# Altium project PressureSensor.PrjPcb
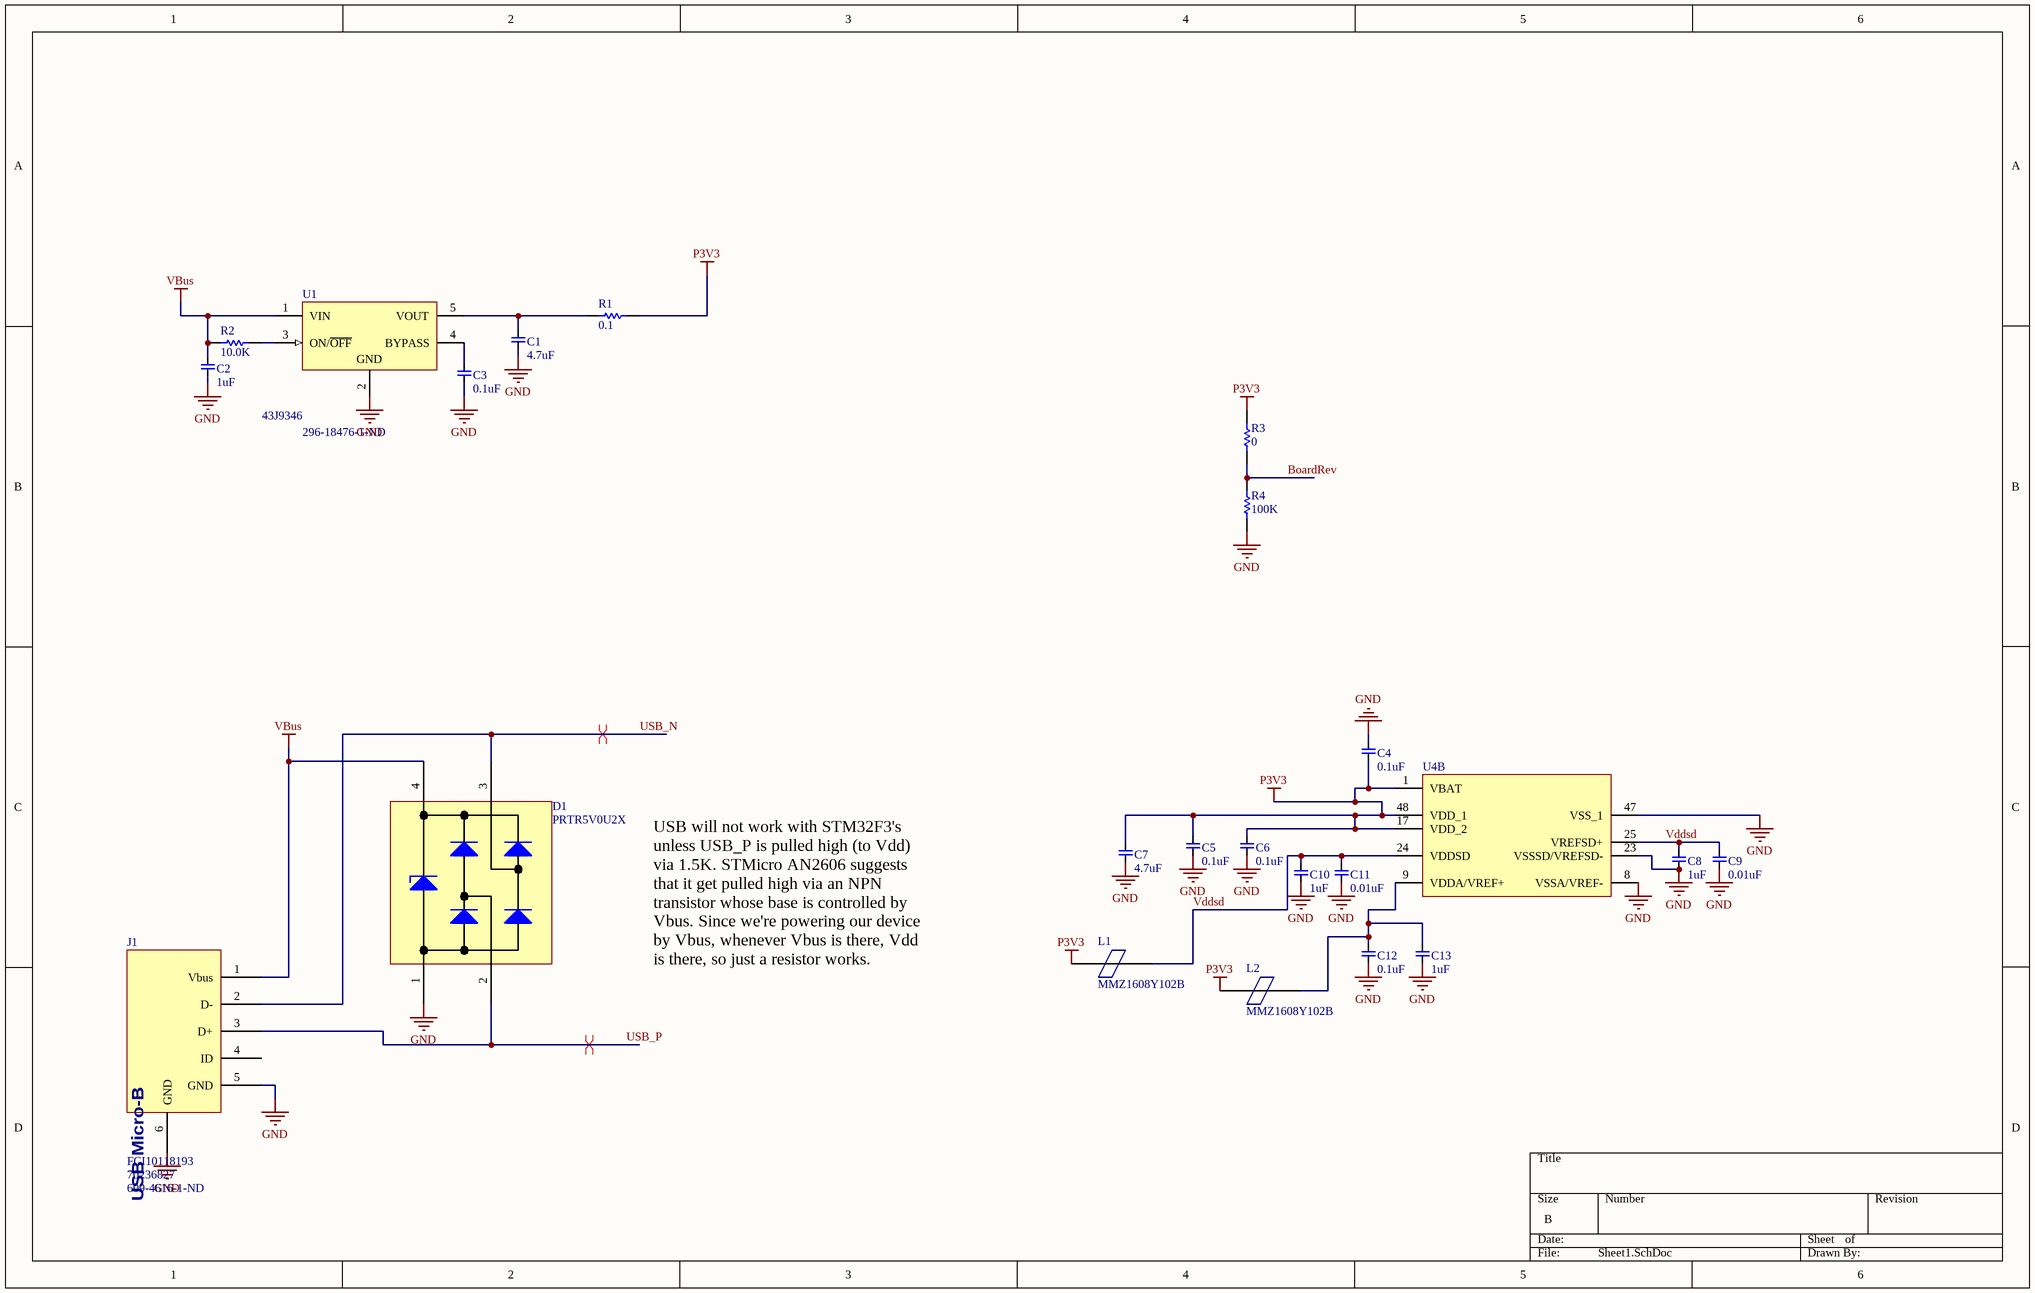
[diagram p0: Sheet1.SchDoc]
2 sheets, 51 parts. Net scope: global (net labels, ports and power ports of the same name join across sheets).
Board file: PressureSensor.PcbDoc
Sheets:
  Sheet1.SchDoc
  Sheet2.SchDoc

## Sheet Sheet1.SchDoc
size B; Organization: Altium Limited; Address1: L3, 12a Rodborough Rd; Address2: Frenchs Forest; Address3: NSW; Address4: Australia 2086

### Parts
C1  4.7uF  [CAP0603]
C2  1uF  [CAP0402]
C3  0.1uF  [CAP0402]
C4  0.1uF  [CAP0402]
C5  0.1uF  [CAP0402]
C6  0.1uF  [CAP0402]
C7  4.7uF  [CAP0603]
C8  1uF  [CAP0603]
C9  0.01uF  [CAP0402]
C10  1uF  [CAP0603]
C11  0.01uF  [CAP0402]
C12  0.1uF  [CAP0402]
C13  1uF  [CAP0603]
D1  PRTR5V0U2X  [SOT190P230X110-4N]
J1  FCI10118193  Supplier Part Number 1: 70236827  Supplier Part Number 2: 609-4616-1-ND  [FCI_10118193]
L1  MMZ1608Y102B  [INDC1608X06N]
L2  MMZ1608Y102B  [INDC1608X06N]
R1  0.1  [RES0402]
R2  10.0K  [RES0402]
R3  0  [RES0402]
R4  100K  [RES0402]
U1  Supplier Part Number 1: 43J9346  Supplier Part Number 2: 296-18476-1-ND  [TI-DBV5_N]
U4  (no value)  [STM-LQFP48_N]  (part B of 2)

### Nets
GND: C1.1 C2.1 C3.1 C4.2 C5.1 C6.1 C7.1 C8.1 C9.1 C10.1 C11.1 C12.1 C13.1 D1.1 J1.5(GND) J1.6(GND) R4.1 U1.2(GND) U4.8(VSSA/VREF-) U4.23(VSSSD/VREFSD-) U4.47(VSS_1)
P3V3: C4.1 C5.2 C6.2 C7.2 L1.1 L2.1 R1.2 R3.2 U4.1(VBAT) U4.17(VDD_2) U4.48(VDD_1)
VBus: C2.2 D1.4 J1.1(Vbus) R2.1 U1.1(VIN)
BoardRev: R3.1 R4.2
USB_N: D1.3 J1.2(D-)
USB_P: D1.2 J1.3(D+)
Vddsd: C8.2 C9.2 C10.2 C11.2 L1.2 U4.24(VDDSD) U4.25(VREFSD+)
NetC1_2: C1.2 R1.1 U1.5(VOUT)
NetC3_2: C3.2 U1.4(BYPASS)
NetC12_2: C12.2 C13.2 L2.2 U4.9(VDDA/VREF+)
NetR2_2: R2.2 U1.3(ON/~{OFF})

Not connected (* = marked no-connect by the designer): J1 4(ID)

### Layout directives
differential pair: USB_N, USB_P

### Notes on the sheet
- USB will not work with STM32F3's unless USB_P is pulled high (to Vdd) via 1.5K. STMicro AN2606 suggests that it get pulled high via an NPN transistor whose base is controlled by Vbus. Since we're powering our device by Vbus, whenever Vbus is there, Vdd is there, so just a resistor works.
- Title
- Size:
- Date:
- File:
- C
- Number:
- Time:
- Revision:
- Sheet
- of
- (in symbol CONN_USB_MICRO-B_HORIZ_TH) USB Micro-B

### Library data of the parts
C1 C7 = 878: CAP 4.7uF +/-10% 10V X6S 0603; Manufacturer: TDK; Manufacturer PN: C1608X6S1A475K; ID: 878; PkgCode: 0603; Value: 4.7uF; Tolerance: +/-10%; Voltage: 10V; Dielectric: X6S; ComponentLink1Description: Datasheet; ComponentLink1URL: http://www.tdk.com/pdf/general_B11.pdf; MaxComponentHeight: 0.9mm
C2 = 596: CAP 1uF +/-10% 10V X5R 0402; Manufacturer: TDK; Manufacturer PN: C1005X5R1A105K; ID: 596; PkgCode: 0402; Value: 1uF; Tolerance: +/-10%; Voltage: 10V; Dielectric: X5R; ComponentLink1Description: Datasheet; ComponentLink1URL: http://www.tdk.com/pdf/general_B11.pdf; MaxComponentHeight: 0.55mm
C3-C6 C12 = 485: CAP 0.1uF +/-10% 25V X7R 0402; Manufacturer: TDK; Manufacturer PN: C1005X7R1E104K; ID: 485; PkgCode: 0402; Value: 0.1uF; Tolerance: +/-10%; Voltage: 25V; Dielectric: X7R; ComponentLink1Description: Datasheet; ComponentLink1URL: http://www.tdk.com/pdf/general_B11.pdf; MaxComponentHeight: 0.55mm
C8 C10 C13 = 820: CAP 1uF +/-10% 25V X7R 0603; Manufacturer: TDK; Manufacturer PN: C1608X7R1E105K; ID: 820; PkgCode: 0603; Value: 1uF; Tolerance: +/-10%; Voltage: 25V; Dielectric: X7R; ComponentLink1Description: Datasheet; ComponentLink1URL: http://www.tdk.com/pdf/general_B11.pdf; MaxComponentHeight: 0.9mm
C9 C11 = 514: CAP 0.01uF +/-20% 50V X6S 0402; Manufacturer: TDK; Manufacturer PN: C1005X6S1H103M; ID: 514; PkgCode: 0402; Value: 0.01uF; Tolerance: +/-20%; Voltage: 50V; Dielectric: X6S; ComponentLink1Description: Datasheet; ComponentLink1URL: http://www.tdk.com/pdf/general_B11.pdf; MaxComponentHeight: 0.55mm
D1 = PRTR5V0U2X: Diode Array, ESD Protection 1pF USB2.0 SOT143; Manufacturer: NXP Semiconductors; ComponentLink1Description: Datasheet; ComponentLink1URL: http://www.nxp.com/documents/data_sheet/PRTR5V0U2X.pdf; Manufacturer PN: PRTR5V0U2X; Supplier 1: Digi-Key; Supplier Part Number 1: 568-4140-1-ND; Supplier 2: Mouser; Supplier Part Number 2: 771-PRTR5V0U2X-T/R; Supplier 3: Newark; Supplier Part Number 3: 75R4845
J1 = CONN_USB_MICRO-B_HORIZ_TH: Connector Receptacle USB - micro B 2.0 5 Position Surface Mount, Right Angle, Horizontal; Manufacturer: FCI; Manufacturer PN: 10118193-0001LF; Supplier 1: Allied; Supplier 2: Digi-Key
L1 L2 = MMZ1608Y102B: Ferrite, 1000oh, 400mA, 0603; ComponentLink1Description: Datasheet; ComponentLink1URL: http://www.tdk.co.jp/tefe02/e9412_mmz.pdf; Supplier 1: Newark; Supplier 2: Digi-Key; Supplier Part Number 1: 33P7606; Supplier Part Number 2: 445-1552-1-ND
R1 = 0402_0.1ohm: RES .1 OHM 1/6W 1% 0402 SMD; Manufacturer: Panasonic; Manufacturer PN: ERJ-2BSFR10X; Value: 0.1; Supplier 1: Arrow; Supplier Part Number 1: 41790361S8773345N1386; Supplier 2: Newark; Supplier Part Number 2: 53W4137; Supplier 3: Allied; Supplier Part Number 3: 70260854; Supplier 4: Digi-Key; Supplier Part Number 4: P.10AKCT-ND
R2 = 963: Resistor SMT 0402 10.0K 1% ohm; Manufacturer: Vishay; Manufacturer PN: CRCW040210K0FKED; ID: 963; Tempco: 100ppm/C; Power: 1/16W; PkgCode: 0402; Value: 10.0K; Tolerance: 1%; Supplier 1: Digi-Key; Supplier Part Number 1: 541-10.0KLCT-ND; ComponentLink1Description: Datasheet; ComponentLink1URL: http://www.vishay.com/docs/20035/dcrcwe3.pdf
R3 = 578: Resistor SMT 0402 0 1% ohm; Manufacturer: Vishay; Manufacturer PN: CRCW04020000Z0ED; ID: 578; Tempco: 100ppm/C; Power: 1/16W; PkgCode: 0402; Value: 0; Tolerance: 1%; Supplier 1: Digi-Key; Supplier Part Number 1: 541-0.0JCT-ND; ComponentLink1Description: Datasheet; ComponentLink1URL: http://www.vishay.com/docs/20035/dcrcwe3.pdf
R4 = 1059: Resistor SMT 0402 100K 1% ohm; Manufacturer: Vishay; Manufacturer PN: CRCW0402100KFKED; ID: 1059; Tempco: 100ppm/C; Power: 1/16W; PkgCode: 0402; Value: 100K; Tolerance: 1%; Supplier 1: Digi-Key; Supplier Part Number 1: 541-100KLCT-ND; ComponentLink1Description: Datasheet; ComponentLink1URL: http://www.vishay.com/docs/20035/dcrcwe3.pdf
U1 = LP2985-33DBVR: Single Output Low Noise LDO, 150 mA, Fixed 3.3 V Output, 2.2 to 16 V Input, with Low IQ, 5-pin SOT-23 (DBV), -40 to 125 degC, Green (RoHS & no Sb/Br); Manufacturer: Texas Instruments; Accuracy(%): 1.5; Fixed Output Options(V): 3.3; Iout(Max)(A): 0.15; Iq(Typ)(mA): 0.85; SubFamily: Single Channel LDO; Vdo(Typ)(mV): 280; Vin(Max)(V): 16; Vin(Min)(V): 2.2; Vout Adj(Max)(V): 10; DatasheetVersion: SLVS522N; PackageVersion: 4073253-4/K; PackageReference: DBV5; PackageDescription: 5-Pin Plastic Small Outline, Body 1.60 Ã— 2.90 mm, Pitch 0.95 mm; Eco-Plan: Green (RoHS & no Sb/Br); Vout Adj(Min)(V): 10; Mounting Technology: Surface Mount; Code_JEDEC: MO-178; PartNumber: LP2985-33DBVR; ComponentLink1Description: Manufacturer URL; ComponentLink1URL: http://www.ti.com/; ComponentLink2Description: Datasheet; ComponentLink2URL: http://www.ti.com/general/docs/lit/getliterature.tsp?genericPartNumber=LP2985-10&fileType=pdf; ComponentLink3Description: Package Specification; ComponentLink3URL: http://www.ti.com/litv/pdf/mpds018i; Supplier 1: Newark; Supplier 2: Digi-Key
U4 = STM32F373CCT6: ARM Cortex-M4 32-bit MCU, 256 KB Flash, 32 KB Internal RAM, 36 I/Os, 48-pin LQFP, -40 to 85 degC, Tray; FLASH Size (Prog) (kB): 256; I/Os (High Current): 36; Internal RAM Size (kB): 32; Operating Frequency(F) (Processor speed) (MHz): 72; Supply Voltage(Vcc) min (V): 2; DatasheetVersion: Rev. 3; PackageVersion: Rev. 6, 06/2013; PackageReference: LQFP48; PackageDescription: 48-Pin Low Profile Quad Flat Package, 7 x 7 mm Body, 0.5 mm Pitch; Supplier 1: Digi-Key; Supplier Part Number 1: 497-13251-ND; Supplier 2: Farnell; Supplier Part Number 2: 2215117; Supplier 3: Newark; Supplier Part Number 3: 46W2195; Supplier 4: Newark; Supplier Part Number 4: 48W6893; Supplier 5: Mouser; Supplier Part Number 5: 511-STM32F373CCT6; Core: ARM Cortex-M4; Packing: Tray; Mounting Technology: Surface Mount; PartNumber: STM32F373CCT6; ComponentLink1Description: Manufacturer URL; ComponentLink1URL: http://www.st.com/web/en/home.html; ComponentLink2Description: Datasheet; ComponentLink2URL: http://www.st.com/st-web-ui/static/active/en/resource/technical/document/datasheet/DM00046749.pdf; ComponentLink3Description: Package Specification; ComponentLink3URL: http://www.st.com/st-web-ui/static/active/en/resource/technical/document/datasheet/DM00058181.pdf

## Sheet Sheet2.SchDoc
size B; Organization: Altium Limited; Address1: L3, 12a Rodborough Rd; Address2: Frenchs Forest; Address3: NSW; Address4: Australia 2086
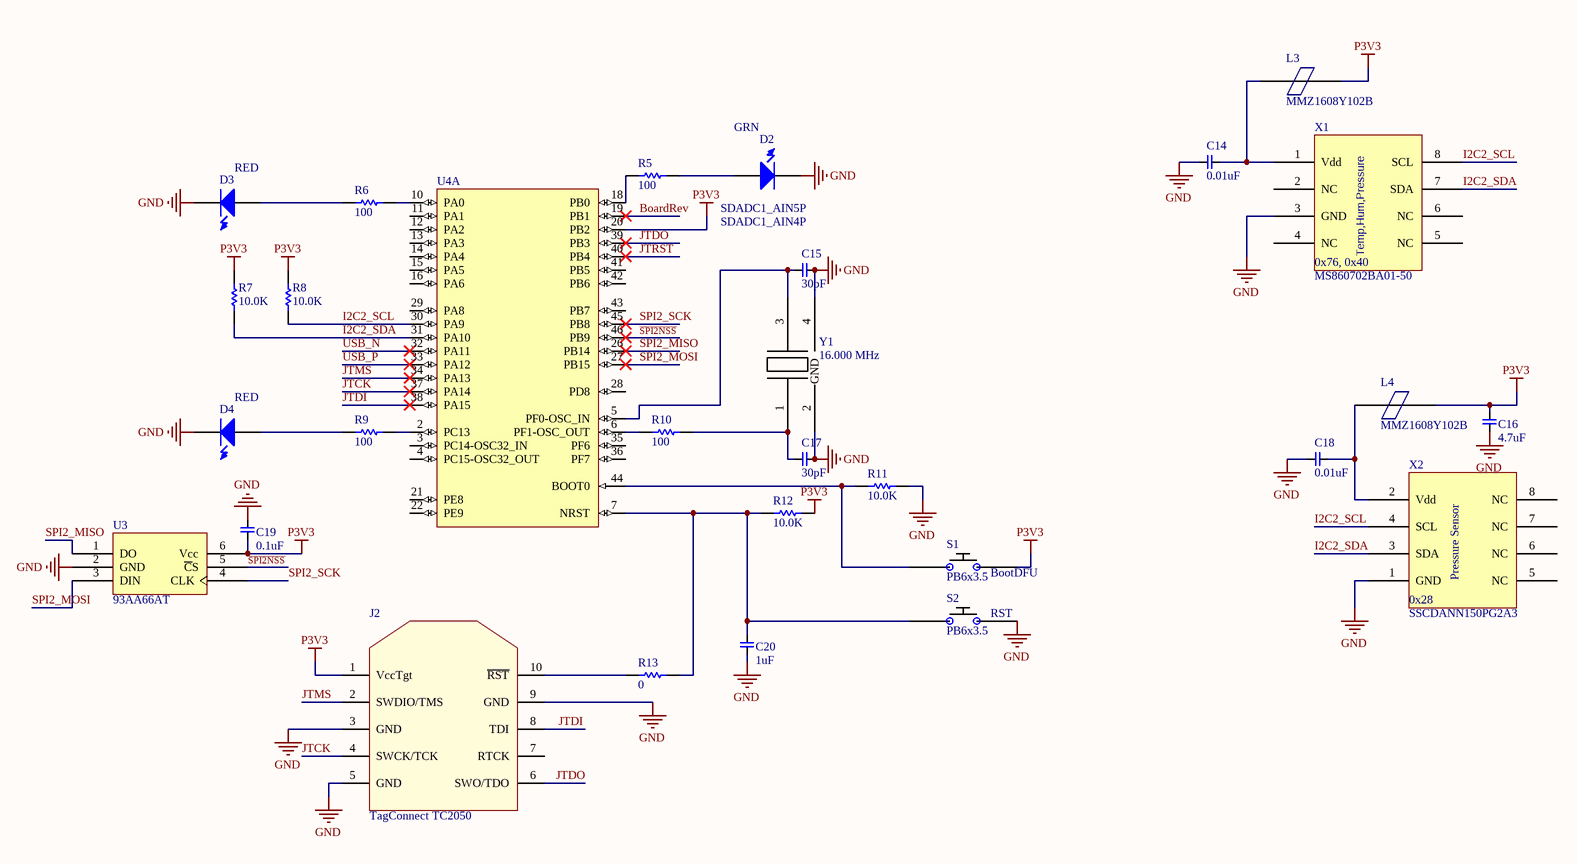
[diagram p1: Sheet2.SchDoc]

### Parts
C14  0.01uF  [CAP0402]
C15  30pF  [CAP0402]
C16  4.7uF  [CAP0603]
C17  30pF  [CAP0402]
C18  0.01uF  [CAP0402]
C19  0.1uF  [CAP0402]
C20  1uF  [CAP0402]
D2  GRN  [KINGBRIGHT_LED]
D3  RED  [KINGBRIGHT_LED]
D4  RED  [KINGBRIGHT_LED]
J2  TagConnect TC2050  [TC2050-IDC]  (no BOM)
L3  MMZ1608Y102B  [INDC1608X06N]
L4  MMZ1608Y102B  [INDC1608X06N]
R5  100  [RES0402]
R6  100  [RES0402]
R7  10.0K  [RES0402]
R8  10.0K  [RES0402]
R9  100  [RES0402]
R10  100  [RES0402]
R11  10.0K  [RES0402]
R12  10.0K  [RES0402]
R13  0  [RES0402]
S1  PB6x3.5  [PTS635]
S2  PB6x3.5  [PTS635]
U3  93AA66AT  [SOT-23-OT6_M]
U4  (no value)  [STM-LQFP48_N]  (part A of 2)
X1  MS860702BA01-50  [TETempHumidityPressSens]
X2  SSCDANN150PG2A3  [HoneywellPsenseDIP]
Y1  16.000 MHz  [CRYSTAL_SMD_3.2x2.5]

### Nets
GND: C14.2 C15.1 C16.2 C17.1 C18.2 C19.2 C20.1 D2.2(K) D3.2(K) D4.2(K) J2.3(GND) J2.5(GND) J2.9(GND) R11.2 S2.2 U3.2(GND) X1.3(GND) X2.1(GND) Y1.2(GND) Y1.4
P3V3: C16.1 C19.1 J2.1(VccTgt) L3.2 L4.2 R7.1 R8.1 R12.2 S1.2 U3.6(Vcc) U4.20(PB2)
~{SPI2NSS}: U3.5(~{C}S) U4.46(PB9)
BoardRev: U4.19(PB1)
I2C2_SCL: R8.2 U4.30(PA9) X1.8(SCL) X2.4(SCL)
I2C2_SDA: R7.2 U4.31(PA10) X1.7(SDA) X2.3(SDA)
JTCK: J2.4(SWCK/TCK) U4.37(PA14)
JTDI: J2.8(TDI) U4.38(PA15)
JTDO: J2.6(SWO/TDO) U4.39(PB3)
JTMS: J2.2(SWDIO/TMS) U4.34(PA13)
JTRST: U4.40(PB4)
SPI2_MISO: U3.1(DO) U4.26(PB14)
SPI2_MOSI: U3.3(DIN) U4.27(PB15)
SPI2_SCK: U3.4(CLK) U4.45(PB8)
USB_N: U4.32(PA11)
USB_P: U4.33(PA12)
NetC14_1: C14.1 L3.1 X1.1(Vdd)
NetC15_2: C15.2 U4.5(PF0-OSC_IN) Y1.3
NetC17_2: C17.2 R10.2 Y1.1
NetC18_1: C18.1 L4.1 X2.2(Vdd)
NetC20_2: C20.2 R12.1 R13.2 S2.1 U4.7(NRST)
NetD2_1: D2.1(A) R5.2
NetD3_1: D3.1(A) R6.1
NetD4_1: D4.1(A) R9.1
NetJ2_10: J2.10(~{RST}) R13.1
NetR5_1: R5.1 U4.18(PB0)
NetR6_2: R6.2 U4.10(PA0)
NetR9_2: R9.2 U4.2(PC13)
NetR10_1: R10.1 U4.6(PF1-OSC_OUT)
NetR11_1: R11.1 S1.1 U4.44(BOOT0)

Not connected (* = marked no-connect by the designer): J2 7(RTCK); U4 3(PC14-OSC32_IN) 4(PC15-OSC32_OUT) 11(PA1) 12(PA2) 13(PA3) 14(PA4) 15(PA5) 16(PA6) 21(PE8) 22(PE9) 28(PD8) 29(PA8) 35(PF6) 36(PF7) 41(PB5) 42(PB6) 43(PB7); X1 2(NC) 4(NC) 5(NC) 6(NC); X2 5(NC) 6(NC) 7(NC) 8(NC)

### Notes on the sheet
- (near D2) SDADC1_AIN5P
- SDADC1_AIN4P
- (near S1) BootDFU
- (near S2) RST
- Title
- Size:
- Date:
- File:
- C
- Number:
- Time:
- Revision:
- Sheet
- of
- (in symbol MS860702BA01-50) Temp,Hum,Pressure; 0x76, 0x40
- (in symbol SSCDANN150PG2A3) Pressure Sensor; 0x28

### Library data of the parts
C14 C18 = 514: as C9 on sheet Sheet1; Value: 0.01uF; Tolerance: +/-20%; Voltage: 50V; Dielectric: X6S; ComponentLink1Description: Datasheet; ComponentLink1URL: http://www.tdk.com/pdf/general_B11.pdf; MaxComponentHeight: 0.55mm
C15 C17 = 388: CAP 30pF +/-5% 50V C0G 0402; Manufacturer: TDK; Manufacturer PN: C1005C0G1H300J; ID: 388; PkgCode: 0402; Value: 30pF; Tolerance: +/-5%; Voltage: 50V; Dielectric: C0G; ComponentLink1Description: Datasheet; ComponentLink1URL: http://www.tdk.com/pdf/general_B11.pdf; MaxComponentHeight: 0.55mm
C16 = 878: as C1 on sheet Sheet1; Value: 4.7uF; Tolerance: +/-10%; Voltage: 10V; Dielectric: X6S; ComponentLink1Description: Datasheet; ComponentLink1URL: http://www.tdk.com/pdf/general_B11.pdf; MaxComponentHeight: 0.9mm
C19 = 485: as C3 on sheet Sheet1; Value: 0.1uF; Tolerance: +/-10%; Voltage: 25V; Dielectric: X7R; ComponentLink1Description: Datasheet; ComponentLink1URL: http://www.tdk.com/pdf/general_B11.pdf; MaxComponentHeight: 0.55mm
C20 = 596: as C2 on sheet Sheet1; Value: 1uF; Tolerance: +/-10%; Voltage: 10V; Dielectric: X5R; ComponentLink1Description: Datasheet; ComponentLink1URL: http://www.tdk.com/pdf/general_B11.pdf; MaxComponentHeight: 0.55mm
D2 = LED_GRN_SMD_0603: LED 1.6X0.8MM 568NM GRN CLR SMD; Manufacturer: Kingbright; Manufacturer PN: APT1608SGC; ComponentLink1Description: Datasheet; ComponentLink1URL: http://www.us.kingbright.com/images/catalog/SPEC/APT1608SURCK.pdf; Supplier 1: Mouser; Supplier Part Number 1: 604-APT1608SGC; Supplier 2: Newark; Supplier Part Number 2: 75R0578; Supplier 3: Digi-Key; Supplier Part Number 3: 754-1121-1-ND
D3 D4 = LED_RED_SMD_0603: LED 1.6X0.8MM 630NM RED CLR SMD; Manufacturer: Kingbright; Manufacturer PN: APT1608SURCK; ComponentLink1Description: Datasheet; ComponentLink1URL: http://www.us.kingbright.com/images/catalog/SPEC/APT1608SURCK.pdf; Supplier 1: Mouser; Supplier Part Number 1: 604-APT1608SURCK; Supplier 2: Digi-Key; Supplier Part Number 2: 754-1123-1-ND; Supplier 3: Newark; Supplier Part Number 3: 75R0573
J2 = TC2050_ARMJTAG: TagConnect TC2050-IDC For ARM JTAG; Manufacturer: Tag-Connect LLC; Manufacturer PN: TC2050-IDC; ComponentLink1Description: Datasheet; ComponentLink1URL: http://www.tag-connect.com/Materials/TC2050-IDC%20Datasheet.pdf
L3 L4 = MMZ1608Y102B: Ferrite, 1000oh, 400mA, 0603; ComponentLink1Description: Datasheet; ComponentLink1URL: http://www.tdk.co.jp/tefe02/e9412_mmz.pdf; Supplier 1: Newark; Supplier 2: Digi-Key; Supplier Part Number 1: 33P7606; Supplier Part Number 2: 445-1552-1-ND
R5 R6 R9 R10 = 771: Resistor SMT 0402 100 1% ohm; Manufacturer: Vishay; Manufacturer PN: CRCW0402100RFKED; ID: 771; Tempco: 100ppm/C; Power: 1/16W; PkgCode: 0402; Value: 100; Tolerance: 1%; Supplier 1: Digi-Key; Supplier Part Number 1: 541-100LCT-ND; ComponentLink1Description: Datasheet; ComponentLink1URL: http://www.vishay.com/docs/20035/dcrcwe3.pdf
R7 R8 R11 R12 = 963: as R2 on sheet Sheet1; Value: 10.0K; Tolerance: 1%; Supplier 1: Digi-Key; Supplier Part Number 1: 541-10.0KLCT-ND; ComponentLink1Description: Datasheet; ComponentLink1URL: http://www.vishay.com/docs/20035/dcrcwe3.pdf
R13 = 578: as R3 on sheet Sheet1; Value: 0; Tolerance: 1%; Supplier 1: Digi-Key; Supplier Part Number 1: 541-0.0JCT-ND; ComponentLink1Description: Datasheet; ComponentLink1URL: http://www.vishay.com/docs/20035/dcrcwe3.pdf
S1 S2 = PushButton_6x3.5mm: SWITCH TACTILE SPST-NO 0.05A 12V 6x3.5MM; Manufacturer: C&K Components; Manufacturer PN: RS-282G05A3-SM RT; ComponentLink1Description: Datasheet; ComponentLink1URL: http://www.ck-components.com/index.php?module=media&action=Display&cmpref=14408&lang=en&width=&height=&format=&alt=; Supplier 1: Digi-Key; Supplier Part Number 1: CKN10384CT-ND; Supplier 2: Arrow; Supplier Part Number 2: XEA-FyxNPVAE8Jp5x5vU7fJ1AuYvsxXnd5y73BrBtfw
U3 = 93AA66AT_SOT23-6: IC EEPROM 4KBIT 2MHZ SOT23-6; Manufacturer: Microchip Technology; Manufacturer PN: 93AA66AT-I/OT; ComponentLink1Description: Datasheet; ComponentLink1URL: http://www.microchip.com/mymicrochip/filehandler.aspx?ddocname=en011819; Supplier 1: Digi-Key; Supplier Part Number 1: 93AA66AT-I/OTCT-ND
U4 = STM32F373CCT6: as U4 on sheet Sheet1; DatasheetVersion: Rev. 3; PackageVersion: Rev. 6, 06/2013; PackageReference: LQFP48; PackageDescription: 48-Pin Low Profile Quad Flat Package, 7 x 7 mm Body, 0.5 mm Pitch; Supplier 1: Digi-Key; Supplier Part Number 1: 497-13251-ND; Supplier 2: Farnell; Supplier Part Number 2: 2215117; Supplier 3: Newark; Supplier Part Number 3: 46W2195; Supplier 4: Newark; Supplier Part Number 4: 48W6893; Supplier 5: Mouser; Supplier Part Number 5: 511-STM32F373CCT6; Core: ARM Cortex-M4; Packing: Tray; Mounting Technology: Surface Mount; PartNumber: STM32F373CCT6; ComponentLink1Description: Manufacturer URL; ComponentLink1URL: http://www.st.com/web/en/home.html; ComponentLink2Description: Datasheet; ComponentLink2URL: http://www.st.com/st-web-ui/static/active/en/resource/technical/document/datasheet/DM00046749.pdf; ComponentLink3Description: Package Specification; ComponentLink3URL: http://www.st.com/st-web-ui/static/active/en/resource/technical/document/datasheet/DM00058181.pdf
X1 = MS860702BA01-50: Humidity, Pressure, Temperature Sensor I²C Output; Manufacturer: TE Connectivity; ManufacturerPN: MS860702BA01-50; ComponentLink1Description: Datasheet; ComponentLink1URL: http://www.te.com/commerce/DocumentDelivery/DDEController?Action=srchrtrv&DocNm=MS8607-02BA01&DocType=DS&DocLang=English; Supplier 1: Digi-Key; Supplier Part Number 1: 223-1701-1-ND
X2 = SSCDANN150PG2A3: SENSOR PRES 150PSI GAUG 3.3V DIP I2C; Manufacturer: Honeywell; ComponentLink1Description: Datasheet; ComponentLink1URL: http://sensing.honeywell.com/index.php?ci_id=151134; Supplier 1: Digi-Key; Supplier 2: Allied; Supplier Part Number 1: 480-5413-ND; Supplier Part Number 2: 70280311; ManufacturerPN: SSCDANN150PG2A3
Y1 = Crystal_16.00MHz_SMD: CRYSTAL 16.0MHZ 20PF,80ohm PARALLEL SMD +/-10PPM; Manufacturer: CTS-Frequency Controls; Manufacturer PN: 403C11E16M00000; ComponentLink1Description: Datasheet; ComponentLink1URL: http://www.ctscorp.com/wp-content/uploads/403.pdf; Supplier 1: Digi-Key; Supplier Part Number 1: CTX732CT-ND; Rm: 80 ohm; CL: 20pf

## Nets that join several sheets
GND: Sheet1 (21 pins), Sheet2 (20 pins)
P3V3: Sheet1 (11 pins), Sheet2 (11 pins)
BoardRev: Sheet1 (R3.1 R4.2), Sheet2 (U4.19)
USB_N: Sheet1 (D1.3 J1.2), Sheet2 (U4.32)
USB_P: Sheet1 (D1.2 J1.3), Sheet2 (U4.33)